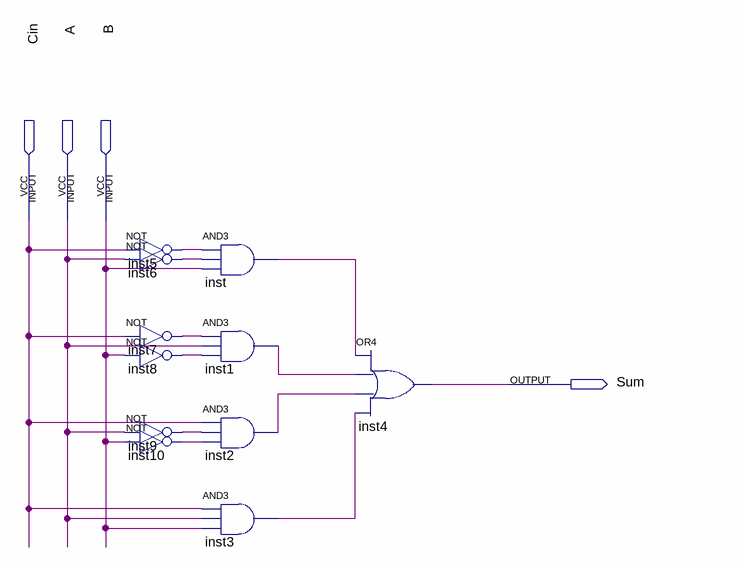
[diagram p0: schematic sheet]
// Quartus schematic Sum.bdf as structural Verilog: 11 symbols, 4 pins
module Sum (
  input  Cin,
  input  A,
  input  B,
  output Sum
);

  wire inst1_out, inst2_out, inst3_out, inst5_out, inst6_out, inst7_out, inst8_out, inst9_out, inst10_out,
       inst_out;

  not inst5 (inst5_out, Cin);
  not inst6 (inst6_out, A);
  not inst7 (inst7_out, Cin);
  not inst8 (inst8_out, B);
  not inst9 (inst9_out, A);
  not inst10 (inst10_out, B);
  and inst (inst_out, inst5_out, inst6_out, B);
  and inst1 (inst1_out, inst7_out, A, inst8_out);
  and inst2 (inst2_out, Cin, inst9_out, inst10_out);
  and inst3 (inst3_out, Cin, A, B);
  or inst4 (Sum, inst_out, inst1_out, inst2_out, inst3_out);
endmodule
